# EAGLE design addon (EAGLE 6.1)
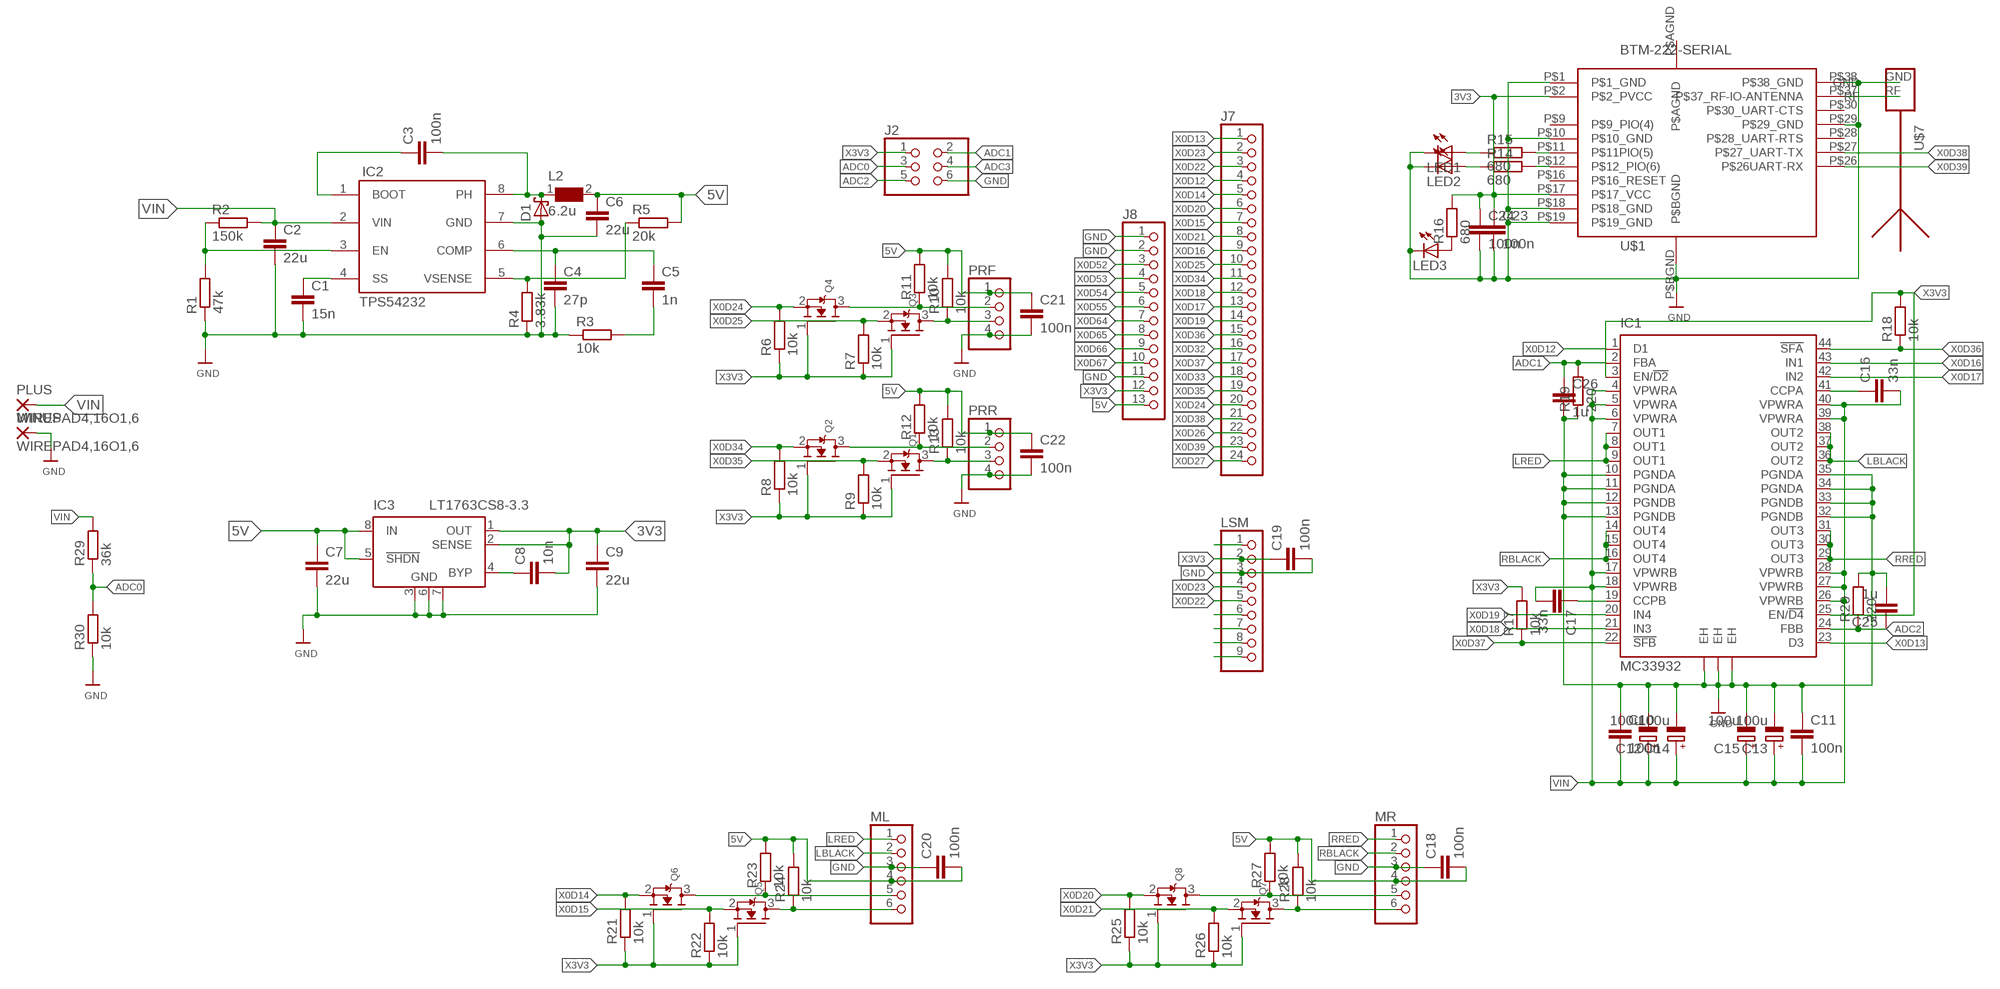
[diagram p0: schematic, sheet 1]

## Parts
C1  15n  C-EUC0603  [C0603]
C2  22u  C-EUC1210  [C1210]
C3  100n  C-EUC0603  [C0603]
C4  27p  C-EUC0603  [C0603]
C5  1n  C-EUC0603  [C0603]
C6  22u  C-EUC1206  [C1206]
C7  22u  C-EUC0603  [C0603]
C8  10n  C-EUC0603  [C0603]
C9  22u  C-EUC0603  [C0603]
C10  100n  C-EUC0603  [C0603]
C11  100n  C-EUC0603  [C0603]
C12  100u  CPOL-EUD/7343-31R  [D/7343-31R]
C13  100u  CPOL-EUD/7343-31R  [D/7343-31R]
C14  100u  CPOL-EUD/7343-31R  [D/7343-31R]
C15  100u  CPOL-EUD/7343-31R  [D/7343-31R]
C16  33n  C-EUC0603  [C0603]
C17  33n  C-EUC0603  [C0603]
C18  100n  C-EUC0603  [C0603]
C19  100n  C-EUC0603  [C0603]
C20  100n  C-EUC0603  [C0603]
C21  100n  C-EUC0603  [C0603]
C22  100n  C-EUC0603  [C0603]
C23  100n  C-EUC0603  [C0603]
C24  100n  C-EUC0603  [C0603]
C25  1u  C-EUC0603  [C0603]
C26  1u  C-EUC0603  [C0603]
D1  SCHOTTKY-DIODESMD  [SMB]
IC1  MC33932  [HSOP44]
IC2  TPS54232  YOURITRONICS_TPS54232  [YOURITRONICS_SO8]
IC3  LT1763CS8-3.3  [SOIC8]
J2  PINHD-2X3  [2X03]
J7  PINHD-1X24  [1X24]
J8  PINHD-1X13  [1X13]
L2  6.2u  EAGLELIBRARY_WUERTH_ELEKTRONIK_EISOS_VERSION_6_WE-TPC_6823  [EAGLELIBRARY_WUERTH_ELEKTRONIK_EISOS_VERSION_6_WE-TPC_6823]
LED1  LEDCHIPLED_0603  [CHIPLED_0603]
LED2  LEDCHIPLED_0603  [CHIPLED_0603]
LED3  LEDCHIPLED_0603  [CHIPLED_0603]
LSM  PINHD-1X9  [1X09]
MINUS  WIREPAD4,16O1,6  [4,16O1,6]
ML  PINHD-1X6  [1X06]
MR  PINHD-1X6  [1X06]
PLUS  WIREPAD4,16O1,6  [4,16O1,6]
PRF  PINHD-1X4  [1X04]
PRR  PINHD-1X4  [1X04]
Q1  MOSFET-NREFLOW  [SOT23-R]
Q2  MOSFET-NREFLOW  [SOT23-R]
Q3  MOSFET-NREFLOW  [SOT23-R]
Q4  MOSFET-NREFLOW  [SOT23-R]
Q5  MOSFET-NREFLOW  [SOT23-R]
Q6  MOSFET-NREFLOW  [SOT23-R]
Q7  MOSFET-NREFLOW  [SOT23-R]
Q8  MOSFET-NREFLOW  [SOT23-R]
R1  47k  R-EU_R0603  [R0603]
R2  150k  R-EU_R0603  [R0603]
R3  10k  R-EU_R0603  [R0603]
R4  3.83k  R-EU_R0603  [R0603]
R5  20k  R-EU_R0603  [R0603]
R6  10k  R-EU_R0603  [R0603]
R7  10k  R-EU_R0603  [R0603]
R8  10k  R-EU_R0603  [R0603]
R9  10k  R-EU_R0603  [R0603]
R10  10k  R-EU_R0603  [R0603]
R11  10k  R-EU_R0603  [R0603]
R12  10k  R-EU_R0603  [R0603]
R13  10k  R-EU_R0603  [R0603]
R14  680  R-EU_R0603  [R0603]
R15  680  R-EU_R0603  [R0603]
R16  680  R-EU_R0603  [R0603]
R17  10k  R-EU_R0603  [R0603]
R18  10k  R-EU_R0603  [R0603]
R19  220  R-EU_R0603  [R0603]
R20  220  R-EU_R0603  [R0603]
R21  10k  R-EU_R0603  [R0603]
R22  10k  R-EU_R0603  [R0603]
R23  10k  R-EU_R0603  [R0603]
R24  10k  R-EU_R0603  [R0603]
R25  10k  R-EU_R0603  [R0603]
R26  10k  R-EU_R0603  [R0603]
R27  10k  R-EU_R0603  [R0603]
R28  10k  R-EU_R0603  [R0603]
R29  36k  R-EU_R0603  [R0603]
R30  10k  R-EU_R0603  [R0603]
U$1  BTM-222-SERIAL  [BTM-222]
U$7  ANTENNA_1RIGHT  [SWRA117D_RIGHT]

## Nets
3V3: C8.2 C9.1 C23.1 C24.1 IC3.1(OUT) IC3.2(SENSE) R16.2 U$1.P$2(P$2_PVCC) U$1.P$17(P$17_VCC)
5V: C6.1 C7.1 C18.2 C20.2 C21.1 C22.1 IC3.5(!SHDN) IC3.8(IN) J8.13 L2.2 ML.4 MR.4 PRF.1 PRR.1 R5.2 R10.2 R11.2 R12.2 R13.2 R23.2 R24.2 R27.2 R28.2
ADC0: J2.3 R29.1 R30.2
ADC1: C26.1 IC1.2(FBA) J2.2 R19.2
ADC2: C25.1 IC1.24(FBB) J2.5 R20.1
ADC3: J2.4
GND: C1.2 C2.2 C4.2 C6.2 C7.2 C9.2 C10.1 C11.1 C12.- C13.- C14.- C15.- C18.1 C19.2 C20.1 C21.2 C22.2 C23.2 C24.2 C25.2 C26.2 D1.A IC1.10(PGNDA) IC1.11(PGNDA) IC1.12(PGNDB) IC1.13(PGNDB) IC1.32(PGNDB) IC1.33(PGNDB) IC1.34(PGNDA) IC1.35(PGNDA) IC1.EH@1(EH) IC1.EH@2(EH) IC1.EH@3(EH) IC2.7(GND) IC3.3(GND) IC3.6(GND) IC3.7(GND) J2.6 J8.1 J8.2 J8.11 LED1.C LED2.C LED3.C LSM.3 MINUS.1(P) ML.3 MR.3 PRF.4 PRR.4 R1.1 R3.1 R4.1 R19.1 R20.2 R30.1 U$1.P$1(P$1_GND) U$1.P$10(P$10_GND) U$1.P$18(P$18_GND) U$1.P$19(P$19_GND) U$1.P$29(P$29_GND) U$1.P$38(P$38_GND) U$1.P$BGND U$7.GND
LBLACK: IC1.36(OUT2) IC1.37(OUT2) IC1.38(OUT2) ML.2
LRED: IC1.7(OUT1) IC1.8(OUT1) IC1.9(OUT1) ML.1
N$1: IC2.3(EN) R1.2 R2.1
N$2: C8.1 IC3.4(BYP)
N$3: PRR.3 Q1.3(D) R13.1
N$4: C3.1 IC2.1(BOOT)
N$5: C3.2 D1.C IC2.8(PH) L2.1
N$6: C1.1 IC2.4(SS)
N$7: PRR.2 Q2.3(D) R12.1
N$8: C4.1 C5.1 IC2.6(COMP)
N$9: PRF.3 Q3.3(D) R10.1
N$10: C5.2 R3.2
N$11: IC2.5(VSENSE) R4.2 R5.1
N$12: PRF.2 Q4.3(D) R11.1
N$13: LSM.1
N$14: U$1.P$37(P$37_RF-IO-ANTENNA) U$7.RF
N$15: R15.2 U$1.P$11(P$11PIO(5))
N$16: R14.2 U$1.P$12(P$12_PIO(6))
N$17: LED1.A R15.1
N$18: LSM.6
N$19: LSM.7
N$20: LSM.8
N$21: LSM.9
N$22: LED2.A R14.1
N$23: LED3.A R16.1
N$24: C16.1 IC1.41(CCPA)
N$25: C17.1 IC1.19(CCPB)
N$26: ML.6 Q5.3(D) R24.1
N$27: ML.5 Q6.3(D) R23.1
N$28: MR.6 Q7.3(D) R28.1
N$29: MR.5 Q8.3(D) R27.1
RBLACK: IC1.14(OUT4) IC1.15(OUT4) IC1.16(OUT4) MR.2
RRED: IC1.29(OUT3) IC1.30(OUT3) IC1.31(OUT3) MR.1
VIN: C2.1 C10.2 C11.2 C12.+ C13.+ C14.+ C15.+ C16.2 C17.2 IC1.4(VPWRA) IC1.5(VPWRA) IC1.6(VPWRA) IC1.17(VPWRB) IC1.18(VPWRB) IC1.26(VPWRB) IC1.27(VPWRB) IC1.28(VPWRB) IC1.39(VPWRA) IC1.40(VPWRA) IC2.2(VIN) PLUS.1(P) R2.2 R29.2
X0D12: IC1.1(D1) J7.4
X0D13: IC1.23(D3) J7.1
X0D14: J7.5 Q6.2(S) R21.2
X0D15: J7.7 Q5.2(S) R22.2
X0D16: IC1.43(IN1) J7.9
X0D17: IC1.42(IN2) J7.13
X0D18: IC1.21(IN3) J7.12
X0D19: IC1.20(IN4) J7.14
X0D20: J7.6 Q8.2(S) R25.2
X0D21: J7.8 Q7.2(S) R26.2
X0D22: J7.3 LSM.5
X0D23: J7.2 LSM.4
X0D24: J7.20 Q4.2(S) R6.2
X0D25: J7.10 Q3.2(S) R7.2
X0D26: J7.22
X0D27: J7.24
X0D32: J7.16
X0D33: J7.18
X0D34: J7.11 Q2.2(S) R8.2
X0D35: J7.19 Q1.2(S) R9.2
X0D36: IC1.44(!SFA) J7.15 R18.1
X0D37: IC1.22(!SFB) J7.17 R17.1
X0D38: J7.21 U$1.P$27(P$27_UART-TX)
X0D39: J7.23 U$1.P$26(P$26UART-RX)
X0D52: J8.3
X0D53: J8.4
X0D54: J8.5
X0D55: J8.6
X0D64: J8.7
X0D65: J8.8
X0D66: J8.9
X0D67: J8.10
X3V3: C19.1 IC1.3(EN/!D2) IC1.25(EN/!D4) J2.1 J8.12 LSM.2 Q1.1(G) Q2.1(G) Q3.1(G) Q4.1(G) Q5.1(G) Q6.1(G) Q7.1(G) Q8.1(G) R6.1 R7.1 R8.1 R9.1 R17.2 R18.2 R21.1 R22.1 R25.1 R26.1
Unconnected: U$1.P$9(P$9_PIO(4)) U$1.P$16(P$16_RESET) U$1.P$28(P$28_UART-RTS) U$1.P$30(P$30_UART-CTS)

## Power pins joined to a net without a drawn wire
P$AGND: U$1.P$AGND

## Library data of the parts
C1-C11 C16-C26 = rcl:C-EU: CAPACITOR, European symbol
C12-C15 = rcl:CPOL-EU: POLARIZED CAPACITOR, European symbol
D1 = diode:SCHOTTKY-DIODE: Schottky Diode
IC1 = freescale:MC33932: 5.0 A Throttle Control H-Bridge Auto generated by make-symbol-device-package-bsdl.ulp Rev. 33 Source: http://www.freescale.com/files/analog/doc/data_sheet/MC33932.pdf?fpsp=1; MPN: MC33932VW; OC_FARNELL: 1701639; OC_NEWARK: 67P3304
IC2 = stuff:YOURITRONICS_TPS54232: The TPS54232 is a 28 V, non-synchronous buck converter that integrates a low RDS(on) high side MOSFET. To increase efficiency at light loads, a pulse skipping Eco-mode? feature is automatically activated. Furthermore, the 1 mA shutdown supplycurrent allows the device to be used in battery powered applications.
IC3 = linear-technology:LT1763CS8: 500mA, Low Noise, LDO Micropower Regulators Source: http://cds.linear.com/docs/Datasheet/1763ff.pdf; MPN: LT1763CS8-3.3; OC_FARNELL: 1273617; OC_NEWARK: 57M6055
J2 = pinhead:PINHD-2X3: PIN HEADER
J7 = pinhead:PINHD-1X24: PIN HEADER
J8 = pinhead:PINHD-1X13: PIN HEADER
L2 = rpiaddon:EAGLELIBRARY_WUERTH_ELEKTRONIK_EISOS_VERSION_6_WE-TPC: Shielded Tiny Power Inductor WE-TPC - Extremely flat power inductor - High current capability - High reliability and perfect soldering characteristics because of integrated soldering pad - magnetically shielded -- Portable power like PDA, digital camera, PCMICA-cards and displays -- DC/DC-converter -- Recommended for switching regulator IC s from Linear Technology, National Semiconductor, Texas Instruments and Fairchild Semiconductor'
LED1-LED3 = led:LED: LED OSRAM: - CHIPLED LG R971, LG N971, LY N971, LG Q971, LY Q971, LO R971, LY R971 LH N974, LH R974 LS Q976, LO Q976, LY Q976 LO Q996 - Hyper CHIPLED LW Q18S LB Q993, LB Q99A, LB R99A - SideLED LS A670, LO A670, LY A670, LG A670, LP A670 LB A673, LV A673, LT A673, LW A673 LH A674 LY A675 LS A676, LA A676, LO A676, LY A676, LW A676 LS A679, LY A679, LG A679 - Hyper Micro SIDELED® LS Y876, LA Y876, LO Y876, LY Y876 LT Y87S - SmartLED LW L88C, LW L88S LB L89C, LB L89S, LG L890 LS L89K, LO L89K, LY L89K LS L896, LA L896, LO L896, LY L896 - TOPLED LS T670, LO T670, LY T670, LG T670, LP T670 LSG T670, LSP T670, LSY T670, LOP T670, LYG T670 LG T671, LOG T671, LSG T671 LB T673, LV T673, LT T673, LW T673 LH T674 LS T676, LA T676, LO T676, LY T676, LB T676, LH T676, LSB T676, LW T676 LB T67C, LV T67C, LT T67C, LS T67K, LO T67K, LY T67K, LW E67C LS E67B, LA E67B, LO E67B, LY E67B, LB E67C, LV E67C, LT E67C LW T67C LS T679, LY T679, LG T679 LS T770, LO T770, LY T770, LG T770, LP T770 LB T773, LV T773, LT T773, LW T773 LH T774 LS E675, LA E675, LY E675, LS T675 LS T776, LA T776, LO T776, LY T776, LB T776 LHGB T686 LT T68C, LB T68C - Hyper Mini TOPLED® LB M676 - Mini TOPLED Santana® LG M470 LS M47K, LO M47K, LY M47K Source: http://www.osram.convergy.de LUXEON: - LUMILED® LXK2-PW12-R00, LXK2-PW12-S00, LXK2-PW14-U00, LXK2-PW14-V00 LXK2-PM12-R00, LXK2-PM12-S00, LXK2-PM14-U00 LXK2-PE12-Q00, LXK2-PE12-R00, LXK2-PE12-S00, LXK2-PE14-T00, LXK2-PE14-U00 LXK2-PB12-K00, LXK2-PB12-L00, LXK2-PB12-M00, LXK2-PB14-N00, LXK2-PB14-P00, LXK2-PB14-Q00 LXK2-PR12-L00, LXK2-PR12-M00, LXK2-PR14-Q00, LXK2-PR14-R00 LXK2-PD12-Q00, LXK2-PD12-R00, LXK2-PD12-S00 LXK2-PH12-R00, LXK2-PH12-S00 LXK2-PL12-P00, LXK2-PL12-Q00, LXK2-PL12-R00 Source: www.luxeon.com KINGBRIGHT: KA-3528ASYC Source: www.kingbright.com
LSM = pinhead:PINHD-1X9: PIN HEADER
MINUS PLUS = wirepad:WIREPAD: Wire PAD connect wire on PCB
ML MR = pinhead:PINHD-1X6: PIN HEADER
PRF PRR = pinhead:PINHD-1X4: PIN HEADER
Q1-Q8 = microbuilder:MOSFET-N: N-Channel Mosfet LEGEND VDS: Voltage Drain-Source ID: Drain Current RDS(ON): Drain-Source On-State Resistance VGS(TH): Gate-Source Threshold Voltage CISS: Drain-Source Input Capacitance SOT-23 Name VDS ID RDS(ON) VGS(TH) CISS Order Number 2N7002E 60V 260mA 2.5 Ohm 2.5V @ 250uA 26.7pF @ 25V 2N7002ET1GOSTR-ND BSH103 30V 850mA 400 mOhm 400mV @ 1mA 83pF @ 24V BSH103,235-ND BSS138 60V 320mA 1.6 Ohm 1.5V @ 250uA 50pF @ 10V Mouser: 771-BSS138PW115 DMN2075U-7 20V 4.2A 38 mOhm 1V @ 250 uA 594.3pF @ 10V DMN2075U-7DICT-ND * BSS138 good choice for I2C level-shifting
R1-R30 = rcl:R-EU_: RESISTOR, European symbol
U$1 = btm-222:BTM-222-SERIAL: Rayson BTM-222 Bluetooth Modul Serial Pins
U$7 = ant-planar-1:ANTENNA_1

## Board
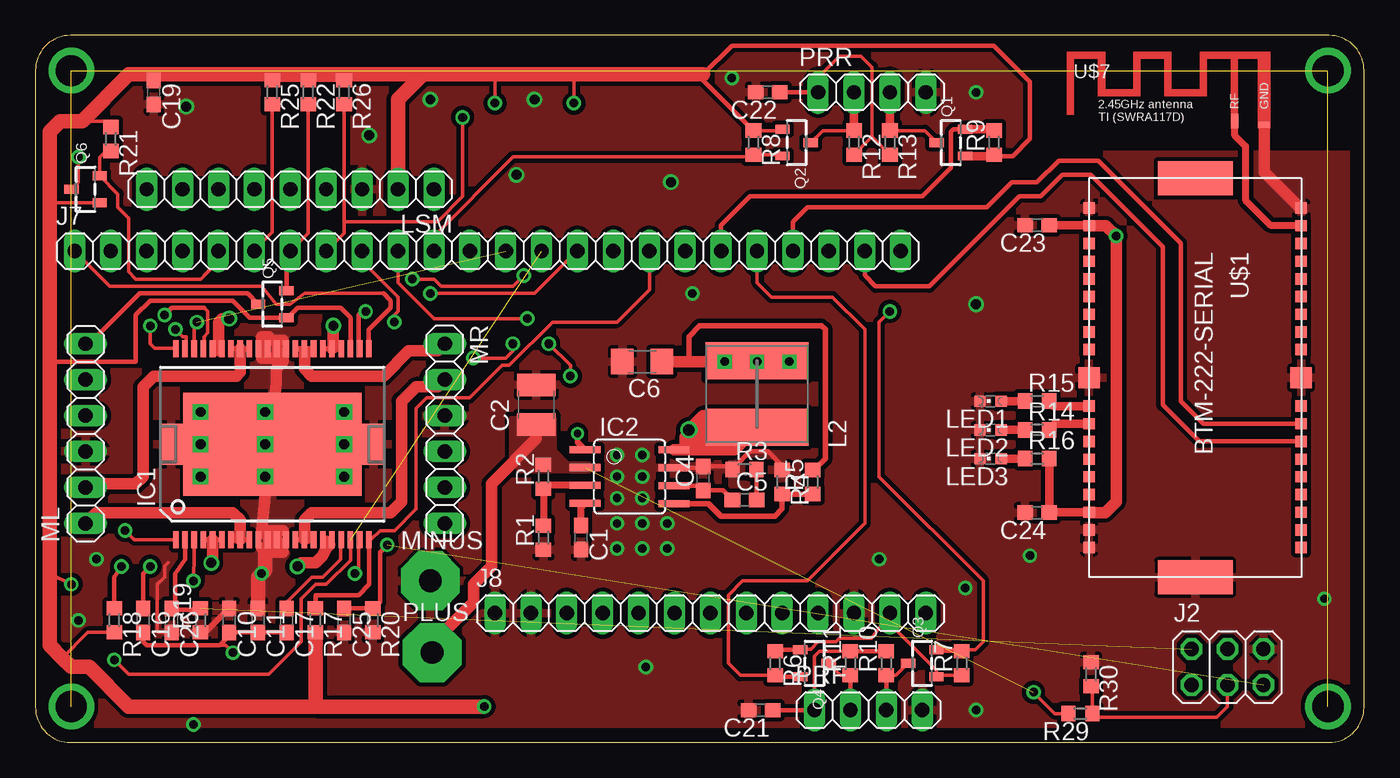
[diagram p1: board, top side]
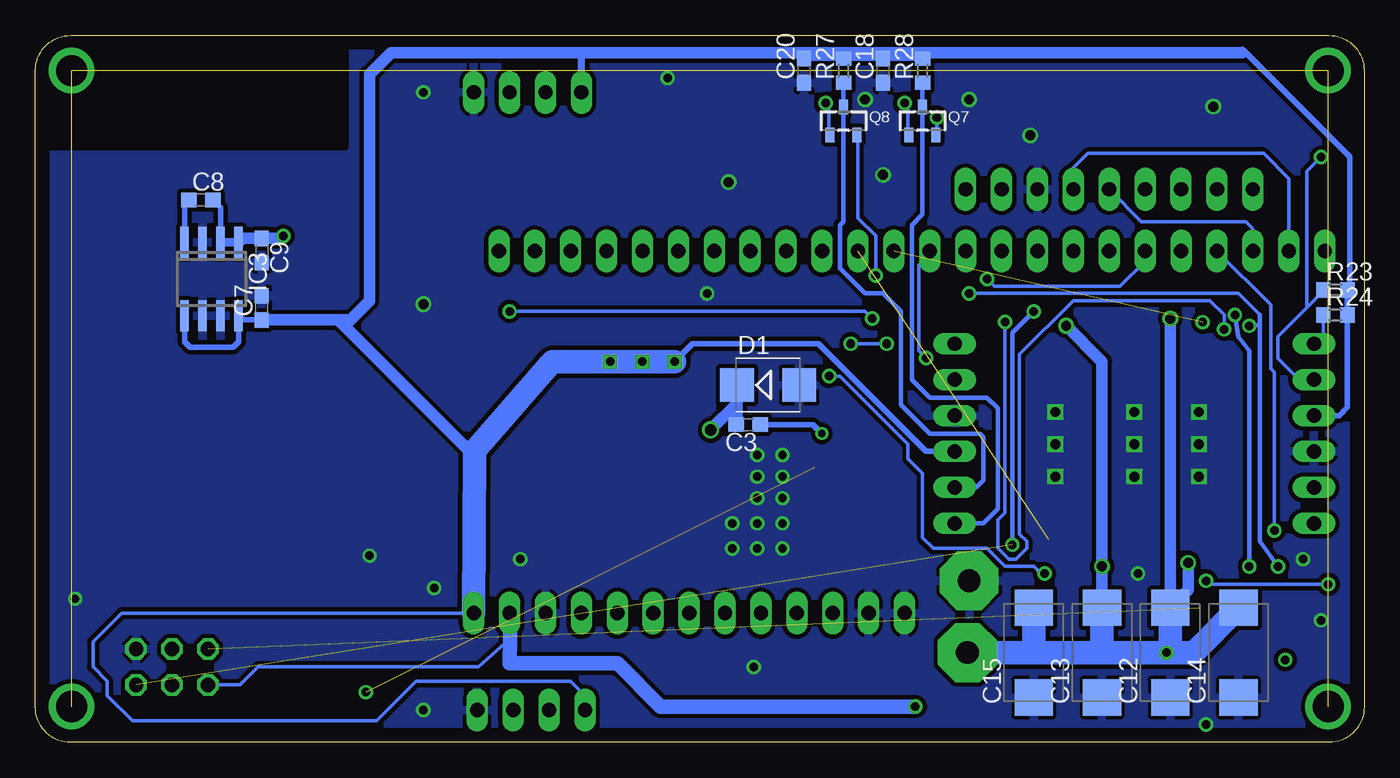
[diagram p2: board, bottom side, seen from below]

Size 94 x 50 mm. Coordinates in mm from the lower left corner, seen from the top.
Outline: 0,47.5 0,2.5 arc90 2.5,0 91.5,0 arc90 94,2.5 94,47.5 arc90 91.5,50 2.5,50 arc90 0,47.5
Copper layers (1*16): Top 0.035mm / dielectric 1.5mm / Bottom 0.035mm
Design rules: minimum track width 10mil, minimum drill 24mil, track to track 8mil, track to pad 8mil, pad to pad 8mil, via to via 8mil, smd to smd 8mil, copper to edge 40mil, drill to drill 8mil, minimum pad ring 10mil, minimum via ring 8mil, stop-mask expansion 4mil, vias tented up to drill 0mil, thermal gap 10mil
tRestrict: area 72.1,42.2 to 93.7,49.5
bRestrict: area 72.1,42.2 to 93.7,49.5

### Footprints (pad centres in the part's own frame; a part is rotated, then mirrored left to right if it is on the bottom)
C0603 = smd 1.1 x 1: 1 -0.85,0; 2 0.85,0
C1210 = smd 1.6 x 2.7: 1 -1.4,0; 2 1.4,0
C1206 = smd 1.6 x 1.8: 1 -1.4,0; 2 1.4,0
D/7343-31R = smd 2.55 x 2.7: + 3.175,0; - -3.175,0
SMB = smd 2.4 x 2.4: A 2.2,0; C -2.2,0
HSOP44 = smd 0.4 x 1.2: 1 -6.825,-6.75; 2 -6.175,-6.75; 3 -5.525,-6.75; 4 -4.875,-6.75; 5 -4.225,-6.75; 6 -3.575,-6.75; 7 -2.925,-6.75; 8 -2.275,-6.75; 9 -1.625,-6.75; 10 -0.975,-6.75; 11 -0.325,-6.75; 12 0.325,-6.75; 13 0.975,-6.75; 14 1.625,-6.75; 15 2.275,-6.75; 16 2.925,-6.75; 17 3.575,-6.75; 18 4.225,-6.75; 19 4.875,-6.75; 20 5.525,-6.75; 21 6.175,-6.75; 22 6.825,-6.75; 23 6.825,6.75; 24 6.175,6.75; 25 5.525,6.75; 26 4.875,6.75; 27 4.225,6.75; 28 3.575,6.75; 29 2.925,6.75; 30 2.275,6.75; 31 1.625,6.75; 32 0.975,6.75; 33 0.325,6.75; 34 -0.325,6.75; 35 -0.975,6.75; 36 -1.625,6.75; 37 -2.275,6.75; 38 -2.925,6.75; 39 -3.575,6.75; 40 -4.225,6.75; 41 -4.875,6.75; 42 -5.525,6.75; 43 -6.175,6.75; 44 -6.825,6.75 | smd 12.6 x 7.3: EH@1 0,0 | smd 1.7 x 2.9: EH@2 -7.15,0; EH@3 7.15,0
YOURITRONICS_SO8 = smd 0.5 x 2.2: 1 -1.905,-3.154; 2 -0.645,-3.154; 3 0.625,-3.154; 4 1.895,-3.154; 5 1.905,3.154; 6 0.635,3.154; 7 -0.635,3.154; 8 -1.905,3.154
SOIC8 = smd 0.6 x 2.2: 1 -1.905,-2.6; 2 -0.635,-2.6; 3 0.635,-2.6; 4 1.905,-2.6; 5 1.905,2.6; 6 0.635,2.6; 7 -0.635,2.6; 8 -1.905,2.6
2X03 = drill 1.016 octagon: 1 -2.54,-1.27; 2 -2.54,1.27; 3 0,-1.27; 4 0,1.27; 5 2.54,-1.27; 6 2.54,1.27
1X24 = drill 1.016 long: 1 -29.21,0; 2 -26.67,0; 3 -24.13,0; 4 -21.59,0; 5 -19.05,0; 6 -16.51,0; 7 -13.97,0; 8 -11.43,0; 9 -8.89,0; 10 -6.35,0; 11 -3.81,0; 12 -1.27,0; 13 1.27,0; 14 3.81,0; 15 6.35,0; 16 8.89,0; 17 11.43,0; 18 13.97,0; 19 16.51,0; 20 19.05,0; 21 21.59,0; 22 24.13,0; 23 26.67,0; 24 29.21,0
1X13 = drill 1.016 long: 1 -15.24,0; 2 -12.7,0; 3 -10.16,0; 4 -7.62,0; 5 -5.08,0; 6 -2.54,0; 7 0,0; 8 2.54,0; 9 5.08,0; 10 7.62,0; 11 10.16,0; 12 12.7,0; 13 15.24,0
EAGLELIBRARY_WUERTH_ELEKTRONIK_EISOS_VERSION_6_WE-TPC_6823 = smd 2.6 x 7.3: 1 -2.35,0; 2 2.35,0
CHIPLED_0603 = smd 0.8 x 0.8: A 0,-0.75; C 0,0.75
1X09 = drill 1.016 long: 1 -10.16,0; 2 -7.62,0; 3 -5.08,0; 4 -2.54,0; 5 0,0; 6 2.54,0; 7 5.08,0; 8 7.62,0; 9 10.16,0
4,16O1,6 = drill 1.6 pad 4.166 octagon: 1 0,0
1X06 = drill 1.016 long: 1 -6.35,0; 2 -3.81,0; 3 -1.27,0; 4 1.27,0; 5 3.81,0; 6 6.35,0
1X04 = drill 1.016 long: 1 -3.81,0; 2 -1.27,0; 3 1.27,0; 4 3.81,0
SOT23-R = smd 0.635 x 1.016: 1 -0.95,-1; 2 0.95,-1; 3 0,1
R0603 = smd 1 x 1.1: 1 -0.85,0; 2 0.85,0
BTM-222 = smd 0.8 x 0.8: P$1 -12.635,-7.5; P$2 -11.385,-7.5; P$3 -10.135,-7.5; P$4 -8.885,-7.5; P$5 -7.635,-7.5; P$6 -6.385,-7.5; P$7 -5.135,-7.5; P$8 -3.885,-7.5; P$9 -2.635,-7.5; P$11 1.365,-7.5; P$12 2.615,-7.5; P$13 3.865,-7.5; P$14 5.115,-7.5; P$15 6.365,-7.5; P$16 7.615,-7.5; P$17 8.865,-7.5; P$18 10.115,-7.5; P$19 11.365,-7.5; P$20 11.365,7.5; P$21 10.115,7.5; P$22 8.865,7.5; P$23 7.615,7.5; P$24 6.365,7.5; P$25 5.115,7.5; P$26 3.865,7.5; P$27 2.615,7.5; P$28 1.365,7.5; P$30 -2.635,7.5; P$31 -3.885,7.5; P$32 -5.135,7.5; P$33 -6.385,7.5; P$34 -7.635,7.5; P$35 -8.885,7.5; P$36 -10.135,7.5; P$37 -11.385,7.5; P$38 -12.635,7.5 | smd 1.5 x 1.5: P$10 -0.635,-7.5; P$29 -0.635,7.5 | smd 2.4 x 5.3: P$AGND -14.735,0; P$BGND 13.465,0
SWRA117D_RIGHT = smd 0.813 x 0.406: GND -0.45,0.25 | smd 0.508 x 1.016: RF -2.55,0.5

### Placement (x,y rotation side)
C1  38.61,14.48 270 top
C2  35.43,23.88 90 top
C3  43.56,22.48 180 bottom
C4  47.24,18.67 90 top
C5  50.16,17.14 0 top
C6  42.93,26.92 180 top
C7  77.98,30.73 90 bottom
C8  82.3,38.35 0 bottom
C9  77.98,34.8 270 bottom
C10  13.72,8.64 270 top
C11  15.75,8.64 270 top
C12  13.72,6.35 90 bottom
C13  18.54,6.35 90 bottom
C14  8.89,6.35 90 bottom
C15  23.37,6.35 90 bottom
C16  7.62,8.64 270 top
C17  17.78,8.64 270 top
C18  34.04,47.5 90 bottom
C19  8.38,45.97 270 top
C20  39.62,47.5 90 bottom
C21  51.31,2.29 180 top
C22  51.82,45.97 180 top
C23  70.87,36.58 180 top
C24  70.87,16.26 180 top
C25  21.84,8.64 270 top
C26  9.65,8.64 270 top
D1  42.16,25.27 0 bottom
IC1  16.76,21.08 0 top
IC2  42.04,18.8 270 top
IC3  81.53,32.77 180 bottom
J2  84.33,5.33 0 top
J7  32,34.75 0 top
J8  47.75,9.14 0 top
L2  51.05,24.64 90 top
LED1  67.56,24.13 90 top
LED2  67.56,22.1 90 top
LED3  67.56,20.07 90 top
LSM  18.03,39.12 180 top
MINUS  27.94,11.43 0 top
ML  3.56,21.84 90 top
MR  28.96,21.84 270 top
PLUS  28.07,6.35 0 top
PRF  58.93,2.29 0 top
PRR  59.18,45.97 0 top
Q1  64.77,42.42 90 top
Q2  53.85,42.42 270 top
Q3  62.74,5.59 90 top
Q4  55.12,5.59 270 top
Q5  16.76,30.99 90 top
Q6  3.56,39.12 90 top
Q7  31.24,43.94 0 bottom
Q8  36.83,43.94 0 bottom
R1  35.94,14.48 90 top
R2  35.94,18.8 90 top
R3  50.16,19.3 0 top
R4  52.83,18.41 270 top
R5  54.99,18.41 90 top
R6  52.32,5.59 270 top
R7  65.53,5.59 90 top
R8  50.8,42.42 270 top
R9  67.82,42.42 90 top
R10  60.2,5.59 90 top
R11  57.66,5.59 90 top
R12  57.91,42.42 270 top
R13  60.45,42.42 270 top
R14  70.87,22.1 0 top
R15  70.87,24.13 0 top
R16  70.87,20.07 0 top
R17  19.81,8.64 270 top
R18  5.59,8.64 270 top
R19  11.68,8.64 90 top
R20  23.88,8.64 270 top
R21  5.33,42.67 270 top
R22  19.3,45.97 270 top
R23  2.03,32 0 bottom
R24  2.03,30.23 0 bottom
R25  16.76,45.97 270 top
R26  21.84,45.97 270 top
R27  36.83,47.5 90 bottom
R28  31.24,47.5 90 bottom
R29  73.91,2.03 180 top
R30  74.68,4.83 270 top
U$1  82.04,25.15 270 top
U$7  87.38,43.43 0 top

### Tracks (layer width: path | path; a pad name or v marks a point on that pad's centre or on a via)
3V3  (via drill 0.6)
  Top 0.61: U$1.P$17 71.74,16.28 | 71.74,16.28 C24.1 | 71.74,16.28 71.74,20.04 R16.2 | C23.1 74.5,36.58 U$1.P$2
  Top 0.813: U$1.P$2 75.74,36.53 v76.45,35.81 76.45,17.02 75.69,16.26 74.57,16.26 U$1.P$17
  Bottom 0.406: IC3.2 80.9,37.81 C8.2
  Bottom 0.61: IC3.2 IC3.1
  Bottom 0.813: IC3.1 79.35,35.65 C9.1 76.62,35.65 v76.45,35.81
5V  (via drill 0.6)
  Top 0.254: C22.1 PRR.1 55.37,46.23 | 59.18,42.84 59.18,47.75 58.42,48.51 56.9,48.51 55.37,46.99 | 59.18,42.84 R13.2 | 59.18,42.84 R12.2 | R11.2 55.46,6.44 55.12,6.1 PRF.1 52.07,2.29
  Top 0.305: C21.1 PRF.1 | R10.2 R11.2 | C22.1 55.12,45.97 55.37,46.23 55.37,46.99
  Top 0.406: 46.23,26.92 46.23,28.7 46.99,29.46 55.63,29.46 55.88,29.21 55.88,20.07 55.08,19.27 R5.2
  Top 0.813: C6.1 46.23,26.92 v48.77,26.92 v51.05,26.92 v53.34,26.92 54.04,26.92 L2.2
  Bottom 0.254: 55.12,2.03 PRF.1 55.12,3.3 56.13,4.32 67.06,4.32 69.85,1.52 87.12,1.52 88.9,3.3 88.9,4.32 89.92,5.33 89.92,7.11 87.88,9.14 J8.13
  Bottom 0.305: 34.04,48.51 33.87,48.35 R27.2 R28.2 C18.2 C20.2 39.62,48.77
  Bottom 0.406: IC3.5 83.44,28.32 83.06,27.94 80.01,27.94 79.63,28.32 IC3.8 79.35,29.88 C7.1 | v48.77,26.92 47.5,28.19 38.61,28.19 30.99,20.57 MR.4 | R23.2 1.44,31.84 1.18,32.09 | 8.64,48.77 8.64,49.02 1.02,41.4 1.02,32.26 1.18,32.09 | 1.18,32.09 R24.2 1.18,23.71 1.78,23.11 ML.4
  Bottom 0.508: PRR.1 55.37,48.77
  Bottom 0.813: C7.1 72.58,29.88 | 72.58,29.88 63.38,20.69 | 63.38,20.69 63.17,20.48 | 62.95,20.62 63.38,20.69 | 72.58,29.88 72.05,29.88 71.88,29.72 70.36,31.24 70.36,47.24 68.83,48.77 55.37,48.77 39.62,48.77 8.64,48.77
  Bottom 1.016: 57.88,26.39 57.88,26.42 57.64,26.66
  Bottom 1.676: J8.13 62.95,20.62 | 62.95,20.62 | 62.95,20.62 57.64,26.66 57.4,26.92 v48.77,26.92
ADC0
  Top 0.254: J2.3 84.33,2.54 83.57,1.78 75.02,1.78 R29.1 74.76,3.98 74.68,4.06 R30.2
ADC1  (1 unrouted)
  Top 0.305: IC1.2 10.59,12.96 9.91,11.94 9.91,9.74 C26.1 9.65,9.4 11.6,9.4 R19.2
ADC2  (via drill 0.6)  (1 unrouted)
  Top 0.305: C25.1 R20.1 24.38,9.91 24.38,13.46 v24.89,13.97 | v23.37,30.48 23.11,30.48 22.86,30.23 22.86,27.91 IC1.24
  Bottom 0.305: v24.89,13.97 24.89,28.96 v23.37,30.48
GND  (via drill 0.6, 0.7)
  Top 0.254: C26.2 8.72,7.79 8.64,7.87 8.64,11.18 9.14,11.68 9.14,12.45 9.4,12.7
  Top 0.305: IC2.7 47.16,19.43 C4.2 49.1,19.52 R3.1 50.04,20.03 50.04,20.07 50.55,20.57 51.82,20.57 52.83,19.56 R4.1
  Top 0.406: R19.1 12.02,7.79 C10.1
  Top 0.813: IC1.12 17.09,13.9 17.53,13.46 16.26,13.46 16,13.72 16.26,13.72 16.51,13.97 16.51,14.48 16,14.99 | 16,14.99 17.53,14.99 | IC1.33 17.09,27.61 17.53,27.18 | 17.53,27.18 16,27.18 16,28.7 16.51,28.7 16.76,28.45 17.53,28.45 | 17.53,27.18 17.53,26.92 17.02,26.42 17.02,25.4 16,14.99 | U$7.GND 86.93,40.33 89.41,37.85
  Top 1.016: 16.26,13.46 16.26,12.19 v16,11.94 15.75,11.68 C11.1
  other vias: 41.15,20.32 42.93,20.32 42.93,18.8 41.15,18.8 41.15,17.27 42.93,17.27 41.15,15.49 41.15,13.72 42.93,13.72 42.93,15.49 44.7,15.49 44.7,13.72 11.68,23.37 11.68,21.08 11.68,18.8 16.26,23.37 16.26,21.08 16.26,18.8 21.84,18.8 21.84,21.08 21.84,23.37 49.28,46.99 66.55,45.97 4.32,12.95 3.05,8.64 11.18,1.27 66.55,2.29 59.69,12.95 65.79,10.92 34.04,40.13 44.96,39.62 23.62,42.93 10.67,44.96 66.55,30.99 27.94,45.47 35.31,45.47 91.19,10.16 70.36,13.21 43.18,5.33 46.48,31.75
  pour Top (isolate 0.305, rank 2): 0,50.04 94.23,50.04 94.23,-0.76 -0.25,-0.76 -0.25,49.78
  pour Bottom (isolate 0.305, rank 2): 0,50.55 93.73,50.55 93.73,0.51 -0.25,0.51 -0.25,50.29
LBLACK
  Top 0.406: IC1.38 IC1.37 IC1.36
  Top 0.813: ML.2 3.81,18.29 7.11,18.29 7.62,18.8 7.62,25.15 8.38,25.91 14.22,25.91 14.49,26.17 IC1.37
LRED
  Top 0.305: IC1.7 IC1.8
  Top 0.406: IC1.8 IC1.9
  Top 0.813: ML.1 4.32,16.26 13.97,16.26 14.49,15.74 IC1.8 14.34,14.48 | 14.34,14.48 14.22,14.48 | 14.34,14.48 14.48,14.48
N$1
  Top 0.508: IC2.3 36.17,18.17 R2.1 R1.2
N$2
  Bottom 0.406: IC3.4 83.44,37.97 83.06,38.35 C8.1
N$3
  Top 0.254: R13.1 62.92,43.27 Q1.3
  Top 0.61: PRR.3 R13.1
N$4  (via drill 0.5)
  Top 0.406: v38.35,21.84 38.35,21.23 IC2.1
  Bottom 0.406: C3.1 38.99,22.48 v38.35,21.84
N$5  (via drill 0.8)
  Top 0.813: L2.1 49.47,20.7 IC2.8 49.4,20.7 51.05,22.35 48.26,22.35 46.74,20.83 46.74,21.34 48.01,22.61 47.75,22.61 45.97,20.83 45.97,21.59 47.5,23.11 47.24,23.11 v46.23,22.1
  Bottom 0.813: D1.C 44.36,23.96 | 44.36,23.96 v46.23,22.1 | 44.36,23.96 44.36,22.53 C3.2
N$6
  Top 0.508: C1.1 38.61,16.63 IC2.4
N$7
  Top 0.254: R12.1 55.7,43.27 Q2.3
  Top 0.61: PRR.2 R12.1
N$8
  Top 0.305: IC2.6 46.9,18.16 C4.1 48.64,17.82 C5.1
N$9
  Top 0.254: R10.1 60.89,4.74 Q3.3
  Top 0.305: PRF.3 R10.1
N$10
  Top 0.305: R3.2 C5.2
N$11
  Top 0.406: IC2.5 47.62,16.89 48.51,16 52.32,16 52.83,16.51 R4.2 R5.1
N$12
  Top 0.254: R11.1 56.97,4.74 Q4.3
  Top 0.305: PRF.2 R11.1
N$14
  Top 0.508: U$7.RF 84.83,42.94 85.6,42.16 85.6,38.35 87.38,36.58 89.5,36.58 U$1.P$37
N$15
  Top 0.61: U$1.P$11 72.06,23.78 R15.2
N$16
  Top 0.61: U$1.P$12 72.15,22.53 R14.2
N$17
  Top 0.61: LED1.A R15.1
N$22
  Top 0.61: LED2.A R14.1
N$23
  Top 0.61: LED3.A R16.1
N$24  (via drill 0.6)
  Top 0.254: 11.94,27.88 11.94,28.7 12.19,28.96 12.19,30.48 11.94,30.73
  Top 0.305: v9.14,30.23 9.65,30.73 11.94,30.73 | 11.94,27.88 IC1.41 | C16.1 7.62,11.94 v8.13,12.45
  Bottom 0.305: v8.13,12.45 8.13,27.69 8.89,28.7 v9.14,30.23
N$25
  Top 0.254: 17.78,9.91 19.56,11.68 20.32,11.68 21.59,12.95 21.59,14.22
  Top 0.305: C17.1 17.78,9.91 | IC1.19 21.64,14.27 21.59,14.22
N$26
  Top 0.305: ML.6 3.81,28.19 7.37,31.75 15,31.75 Q5.3
  Bottom 0.254: R24.1 2.88,28.87 ML.6
N$27  (via drill 0.6)
  Top 0.254: v3.05,41.4 3.05,39.61 Q6.3
  Bottom 0.254: ML.5 4.57,25.65 6.1,27.18 6.1,28.7 4.06,30.73 | 4.06,30.73 4.06,40.39 v3.05,41.4 | R23.1 3.56,31.24 4.06,30.73
N$28
  Bottom 0.254: 31.24,44.96 Q7.3
  Bottom 0.305: R28.1 31.24,44.96 | Q7.3 31.24,37.34 32,36.58 32,25.65 30.73,24.38 26.67,24.38 25.91,23.62 25.91,16.51 26.92,15.49 MR.6
N$29
  Bottom 0.305: R27.1 Q8.3 36.83,36.83 37.08,36.58 37.08,33.53 35.31,31.75 34.04,31.75 32.77,30.48 32.77,23.88 30.73,21.84 27.18,21.84 26.92,21.59 26.92,18.54 27.43,18.03 MR.5
N$30  (via drill 0.6)
  other vias: 5.59,5.84
N$31  (via drill 0.6)
  other vias: 8.13,29.46
N$32  (via drill 0.6)
  other vias: 11.43,29.72
N$33  (via drill 0.6)
  other vias: 70.61,3.56
N$34  (via drill 2.2 pad 0.3)  (3 unrouted)
  other vias: 2.54,47.5 2.54,2.54 91.44,47.5 91.44,2.54
RBLACK
  Top 0.305: IC1.16 19.69,14.35 19.56,14.48 19.3,14.48
  Top 0.406: IC1.14 IC1.15
  Top 0.813: MR.2 28.45,25.15 26.92,25.15 25.91,24.13 25.91,17.02 25.15,16.26 19.56,16.26 19.04,15.74 IC1.15 19.18,14.48 19.3,14.48
RRED
  Top 0.254: IC1.30 19.05,27.94 19.05,27.69
  Top 0.406: IC1.29 IC1.30 IC1.31
  Top 0.813: MR.1 28.45,27.69 26.42,27.69 24.64,25.91 19.56,25.91 19.05,26.42 19.05,27.69
VIN  (via drill 0.6, 0.7)  (1 unrouted)
  Top 0.254: 32,12.45 32.26,12.45 | 13.04,6.86 13.46,6.86 v13.97,6.35 | R29.2 72.14,2.03 70.61,3.56 | PLUS.1 28.07,6.48 27.94,6.6
  Top 0.305: 20.57,14.22 20.45,14.22 IC1.17 | 20.83,13.97 20.83,14.17 IC1.18 | C17.2 C11.2 13.97,7.79 | C10.2 13.97,7.79 | C16.2 7.62,7.11 7.87,6.86 13.04,6.86 13.97,7.79
  Top 0.406: IC1.4 IC1.5 IC1.6 | IC1.40 IC1.39 12.95,27.83 12.95,27.69 | IC1.26 IC1.27 IC1.28
  Top 0.813: v13.72,29.97 13.21,29.97 12.95,29.72 12.95,27.69 | v21.08,29.46 21.08,27.93 IC1.27 | IC1.5 12.54,12.79 v12.45,12.7 | 20.57,14.22 20.83,13.97 20.57,13.72 20.32,13.21 19.81,12.7 18.8,12.7 v18.54,12.45 | C2.1 35.43,21.46 32.26,18.29 32.26,12.45 30.99,11.18 30.99,9.91 28.07,6.99 28.07,6.48
  Bottom 0.305: 8.89,10.67 C14.+
  Bottom 0.813: v13.72,29.97 C12.+ 12.45,10.79 v12.45,12.7 | C13.+ v18.54,12.45 18.54,26.92 v21.08,29.46
  Bottom 1.676: PLUS.1 23.37,6.35 | 23.37,6.35 18.54,6.35 | 18.54,6.35 v13.97,6.35 | v13.97,6.35 12.06,6.35 C14.+ | C12.+ 13.72,6.6 v13.97,6.35 | C15.+ 23.37,6.35 | C13.+ 18.54,6.35
  pour Top (isolate 0.406, no thermals): 33.78,20.32 33.78,22.86 35.31,22.61 36.58,22.86 36.58,20.57 37.59,19.56 39.12,19.56 39.12,19.3 34.29,19.3
X0D12  (via drill 0.6)
  Top 0.254: IC1.1 7,14.33 v6.35,14.99
  Bottom 0.254: v6.35,14.99 6.35,26.16 6.6,26.42 6.6,30.94 J7.4
X0D13
  Top 0.254: 24.64,31.75 19.05,31.75 18.03,30.99 17.02,30.99 16,32.26 5.28,32.26 J7.1
  Top 0.305: IC1.23 23.59,29.18 25.15,30.73 25.15,31.24 24.64,31.75
X0D14
  Top 0.254: 11.94,33.02 12.95,34.03 J7.5 12.95,34.04 11.68,32.77 7.11,32.77 6.6,33.27 6.6,37.08 5.84,37.85 5.84,38.78 Q6.2 4.56,41.39 5.33,42.16 R21.2
X0D15
  Top 0.254: R22.2 19.3,36.02 J7.7
  Top 0.305: Q5.2 17.76,34.48 J7.7
X0D16  (via drill 0.6, 0.61)
  Top 0.254: v25.4,29.72 25.4,30.23 25.65,30.48 25.65,31.5 23.11,34.04 23.11,34.54 J7.9 | IC1.43 10.67,27.94 10.67,28.7 10.41,28.7 v9.91,29.21
  Bottom 0.254: v25.4,29.72 25.4,16.26 25.91,15.75 25.91,13.72 25.15,12.95 24.64,12.95 23.88,13.72 23.88,14.22 24.38,14.73 24.38,27.43 20.57,31.24 10.92,31.24 9.91,30.23 v9.91,29.21
X0D17  (1 unrouted)
  Top 0.254: IC1.42 11.24,29.53 11.43,29.72
X0D18  (via drill 0.61)
  Top 0.254: v30.99,27.18 33.27,27.18 33.78,27.69 v33.78,28.19 | v36.32,28.19 37.85,26.67 v37.85,25.91 | IC1.21 22.86,14.22 22.86,12.19 v22.61,11.94
  Bottom 0.254: v30.99,27.18 31.5,27.69 31.5,33.78 30.73,34.54 J7.12 | v36.32,28.19 v33.78,28.19 | v37.85,25.91 37.08,25.91 32.26,21.08 32.26,20.07 31.24,19.05 31.24,14.48 30.48,13.72 26.67,13.72 25.4,12.45 23.37,12.45 22.86,11.94 v22.61,11.94
X0D19  (1 unrouted)
  Top 0.254: IC1.20 22.29,12.89 20.57,11.18 19.81,11.18 18.8,10.16 18.8,7.11 16.51,4.83 6.6,4.83 5.59,5.84
X0D20  (via drill 0.61)
  Top 0.254: R25.2 16.76,36.07 15.49,34.8 J7.6 | v34.54,33.02 33.78,32.26 28.7,32.26 28.19,32.77 v26.67,32.77
  Bottom 0.254: v34.54,33.02 34.54,35.81 35.81,37.08 35.81,42.93 Q8.2 | v26.67,32.77 26.16,32.26 17.27,32.26 15.49,34.04 15.49,34.54 J7.6
X0D21  (via drill 0.61)
  Top 0.254: R26.2 21.84,36.83 | 21.84,36.83 21.84,36.02 J7.8 | v30.23,44.2 30.23,38.61 28.45,36.83 21.84,36.83
  Bottom 0.254: v30.23,44.2 30.23,43.18 Q7.2
X0D22
  Bottom 0.254: J7.3 7.87,36.32 8.38,36.83 15.75,36.83 LSM.5
X0D23
  Bottom 0.254: J7.2 5.33,39.87 7.11,41.66 19.56,41.66 20.57,40.64 LSM.4
X0D24
  Top 0.254: R6.2 49.87,4.74 49.02,5.59 49.02,10.41 50.04,11.43 54.61,11.43 58.67,15.49 58.67,29.21 56.39,31.5 52.07,31.5 51.05,32.51 J7.20
  Top 0.305: Q4.2 52.42,4.64 R6.2
X0D25  (via drill 0.6)
  Top 0.254: R7.2 63.84,6.44 Q3.2 66.48,6.54 67.06,7.11 67.06,11.43 59.69,18.8 59.69,29.72 v60.45,30.48 | v34.8,29.97 28.19,29.97 25.65,32.51 J7.10
  Top 0.61: 65.69,6.54 R7.2
  Bottom 0.254: v60.45,30.48 35.31,30.48 v34.8,29.97
X0D34
  Top 0.254: Q2.2 52.75,41.57 R8.2 50.8,41.66 50.55,41.4 33.78,41.4 28.19,35.81 J7.11
X0D35
  Top 0.305: Q1.2 64.96,43.37 64.77,43.18 64.77,40.64 62.74,38.61 50.55,38.61 48.51,36.58 J7.19
  Top 0.61: Q1.2 67.72,43.37 R9.2
X0D36  (via drill 0.6)
  Top 0.254: v27.94,31.75 35.31,31.75 38.35,34.8 J7.15 | 9.91,27.86 8.46,27.86 8.13,28.19 v8.13,29.46
  Top 0.305: R18.1 5.59,11.68 v6.1,12.45 | 9.91,27.86 IC1.44
  Bottom 0.254: 7.37,30.23 8.89,31.75 v27.94,31.75 | v8.13,29.46 7.62,29.46 7.37,29.72
  Bottom 0.305: v6.1,12.45 7.37,14.22 7.37,29.72 7.37,30.23
X0D37
  Top 0.254: IC1.22 23.73,14.33 24.38,14.99 25.4,14.99 26.92,16.51 26.92,23.62 27.69,24.38 30.73,24.38 33.02,26.67 33.53,26.67 36.58,29.72 41.15,29.72 43.43,32 J7.17
  Top 0.305: R17.1 19.81,10.41 22.86,10.41 23.62,11.18 23.62,14.3 IC1.22
X0D38
  Top 0.305: U$1.P$27 82.62,22.53 81.03,24.13 81.03,35.31 75.18,41.15 72.39,41.15 70.87,39.62 69.09,39.62 67.31,37.85 54.61,37.85 53.59,36.83 J7.21
X0D39
  Top 0.305: U$1.P$26 82.35,21.28 79.76,23.88 79.76,35.05 74.68,40.13 72.64,40.13 71.12,38.61 69.6,38.61 63.25,32.26 59.44,32.26 58.67,33.02 J7.23
X3V3  (via drill 0.6, 0.61)
  Top 0.254: R8.1 52.75,43.27 Q2.1 | IC1.3 11.24,12.76 v11.18,11.43 | v2.54,11.18 1.02,11.94 | R7.1 63.84,4.74 Q3.1 63.74,5.1 60.45,8.38 J8.12 59.14,7.37 56.9,7.37 56.64,7.11 55.37,7.11 54.86,6.6 52.58,6.6 52.41,6.44 R6.1 | 6.6,47.24 7.96,47.24 C19.1 | R22.1 R25.1 R26.1 22.19,46.82 22.61,47.24 | Q6.1 1.34,38.17 1.02,37.85 | 3.3,43.94 4.91,43.94 R21.1 | 32.51,47.24 v32.51,45.21 | 38.1,47.24 v38.1,45.21 | 17.78,29.97 Q5.1 | R18.2 3.72,7.79 1.91,5.97
  Top 0.305: R8.1 47.24,46.82 47.24,47.24 49.28,49.28 67.82,49.28 70.36,46.74 70.36,42.67 69.15,41.47 Q1.1 | Q4.1 52.42,6.54 R6.1 | IC1.25 22.29,30.04 21.59,30.73 18.54,30.73 17.78,29.97 | Q5.1 15.17,30.04 13.97,31.24 8.13,31.24 7.11,30.23 7.11,26.92 1.27,26.92 1.02,26.67
  Top 0.61: 65.69,4.64 R7.1 | Q1.1 67.72,41.47 R9.1
  Top 1.016: R17.2 19.81,2.54 | 19.81,2.54 v31.75,2.54 | 27.43,47.24 22.61,47.24 6.6,47.24 3.3,43.94 1.78,43.94 1.02,43.18 1.02,37.85 1.02,26.67 1.02,11.94 1.02,6.86 1.91,5.97 2.54,5.33 3.81,5.33 6.6,2.54 19.81,2.54 | 27.43,47.24 32.51,47.24 38.1,47.24 47.24,47.24 | LSM.2 25.65,45.47 27.43,47.24
  Bottom 0.254: v11.18,11.43 10.67,11.18 v2.54,11.18 | J2.1 79.5,4.06 78.23,5.33 62.65,5.33 60.41,7.32 | v32.51,45.21 32.26,44.96 32.26,43.18 Q7.1 | v38.1,45.21 37.85,44.96 37.85,43.18 Q8.1
  Bottom 1.016: J8.12 60.41,7.32 60.45,5.59 52.83,5.59 49.78,2.54 v31.75,2.54